# EAGLE design Tait USB programmer v2 (EAGLE 9.5.2)
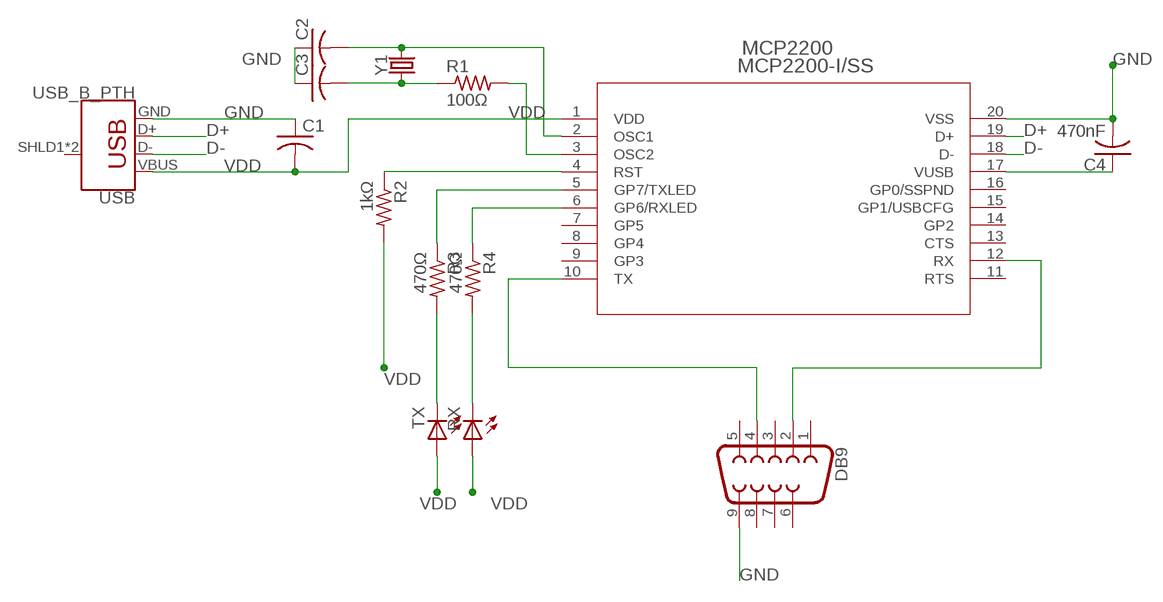
[diagram p0: schematic, sheet 1]

## Parts
C1  0.1uF  C-US025-025X050  [C025-025X050]
C2  22pF  C-US025-025X050  [C025-025X050]
C3  22pF  C-US025-025X050  [C025-025X050]
C4  470nF  C-US025-025X050  [C025-025X050]
DB9  DB9FEMALE  [DB9]
MCP2200  MCP2200-I/SS  [SSOP20_MC_MCH]
R1  100Ω  R-US_0204/7  [0204/7]
R2  1kΩ  R-US_0204/7  [0204/7]
R3  470Ω  R-US_0204/7  [0204/7]
R4  470Ω  R-US_0204/7  [0204/7]
RX  LED3MM  [LED3MM]
TX  LED3MM  [LED3MM]
USB  USB_B_PTH  [USB-B-PTH]
Y1  12MHz  CRYSTALPTH-HC49UV  [HC49U]

## Nets
D+: MCP2200.19(D+) USB.D+
D-: MCP2200.18(D-) USB.D-
GND: C1.1 C2.1 C3.1 C4.2 DB9.9 MCP2200.20(VSS) USB.GND
N$1: C3.2 R1.1 Y1.1
N$2: MCP2200.4(RST) R2.1
N$3: R3.2 TX.K(C)
N$4: C2.2 MCP2200.2(OSC1) Y1.2
N$5: C4.1 MCP2200.17(VUSB)
N$6: DB9.2 MCP2200.12(RX)
N$7: DB9.4 MCP2200.10(TX)
N$8: R4.2 RX.K(C)
N$9: MCP2200.6(GP6/RXLED) R4.1
N$10: MCP2200.3(OSC2) R1.2
N$11: MCP2200.5(GP7/TXLED) R3.1
VDD: C1.2 MCP2200.1(VDD) R2.2 RX.A TX.A USB.VBUS
Unconnected: DB9.1 DB9.3 DB9.5 DB9.6 DB9.7 DB9.8 MCP2200.7(GP5) MCP2200.8(GP4) MCP2200.9(GP3) MCP2200.11(RTS) MCP2200.13(CTS) MCP2200.14(GP2) MCP2200.15(GP1/USBCFG) MCP2200.16(GP0/SSPND) USB.SHLD1(SHIELD) USB.SHLD2(SHIELD)

## Library data of the parts
C1-C4 = adafruit:C-US: CAPACITOR, American symbol
DB9 = SparkFun-Connectors:DB9: DB9 Connector Standard DB9 (D-Sub 9) serial connector. Can be used for CAN bus as well as RS485 and RS232. Footprint production proven. Here is the female version connector we sell at SparkFun: 9 Pin Female Serial Connector - PCB Mount <https://www.sparkfun.com/products/429> (PRT-00429) This connector has been used on the following SparkFun products: SparkFun RS232 Shifter - SMD <https://www.sparkfun.com/products/449> (PRT-00449) SparkFun RS232 Shifter SMD (No DB9) <https://www.sparkfun.com/products/8780> (PRT-08780); PROD_ID: CONN-08194
MCP2200 = mcp2200:MCP2200-I/SS; BUILT_BY: EMA_UL_Team; MANUFACTURER_PART_NUMBER: mcp2200-i/ss; SOURCELIBRARY: Microchip_2011-05-13; VENDOR: Microchip
R1-R4 = adafruit:R-US_: RESISTOR, American symbol
RX TX = adafruit:LED: LED OSRAM: - CHIPLED LG R971, LG N971, LY N971, LG Q971, LY Q971, LO R971, LY R971 LH N974, LH R974 LS Q976, LO Q976, LY Q976 LO Q996 - Hyper CHIPLED LW Q18S LB Q993, LB Q99A, LB R99A - SideLED LS A670, LO A670, LY A670, LG A670, LP A670 LB A673, LV A673, LT A673, LW A673 LH A674 LY A675 LS A676, LA A676, LO A676, LY A676, LW A676 LS A679, LY A679, LG A679 - Hyper Micro SIDELED® LS Y876, LA Y876, LO Y876, LY Y876 LT Y87S - SmartLED LW L88C, LW L88S LB L89C, LB L89S, LG L890 LS L89K, LO L89K, LY L89K LS L896, LA L896, LO L896, LY L896 - TOPLED LS T670, LO T670, LY T670, LG T670, LP T670 LSG T670, LSP T670, LSY T670, LOP T670, LYG T670 LG T671, LOG T671, LSG T671 LB T673, LV T673, LT T673, LW T673 LH T674 LS T676, LA T676, LO T676, LY T676, LB T676, LH T676, LSB T676, LW T676 LB T67C, LV T67C, LT T67C, LS T67K, LO T67K, LY T67K, LW E67C LS E67B, LA E67B, LO E67B, LY E67B, LB E67C, LV E67C, LT E67C LW T67C LS T679, LY T679, LG T679 LS T770, LO T770, LY T770, LG T770, LP T770 LB T773, LV T773, LT T773, LW T773 LH T774 LS E675, LA E675, LY E675, LS T675 LS T776, LA T776, LO T776, LY T776, LB T776 LHGB T686 LT T68C, LB T68C - Hyper Mini TOPLED® LB M676 - Mini TOPLED Santana® LG M470 LS M47K, LO M47K, LY M47K Source: http://www.osram.convergy.de/
USB = SparkFun-Connectors:USB_B: USB Type B Connector SparkFun Products: SparkFun Stepoko <https://www.sparkfun.com/products/13899> PTH; PROD_ID: CONN-08278; SF_ID: PRT-00139
Y1 = SparkFun-Clocks:CRYSTAL: Crystals (Generic) These are passive quartz crystals, which can be used as a clock source for a microcontroller. Crystal's are two-terminal devices. They require external "load" capacitors to generate an oscillating signal.

## Board
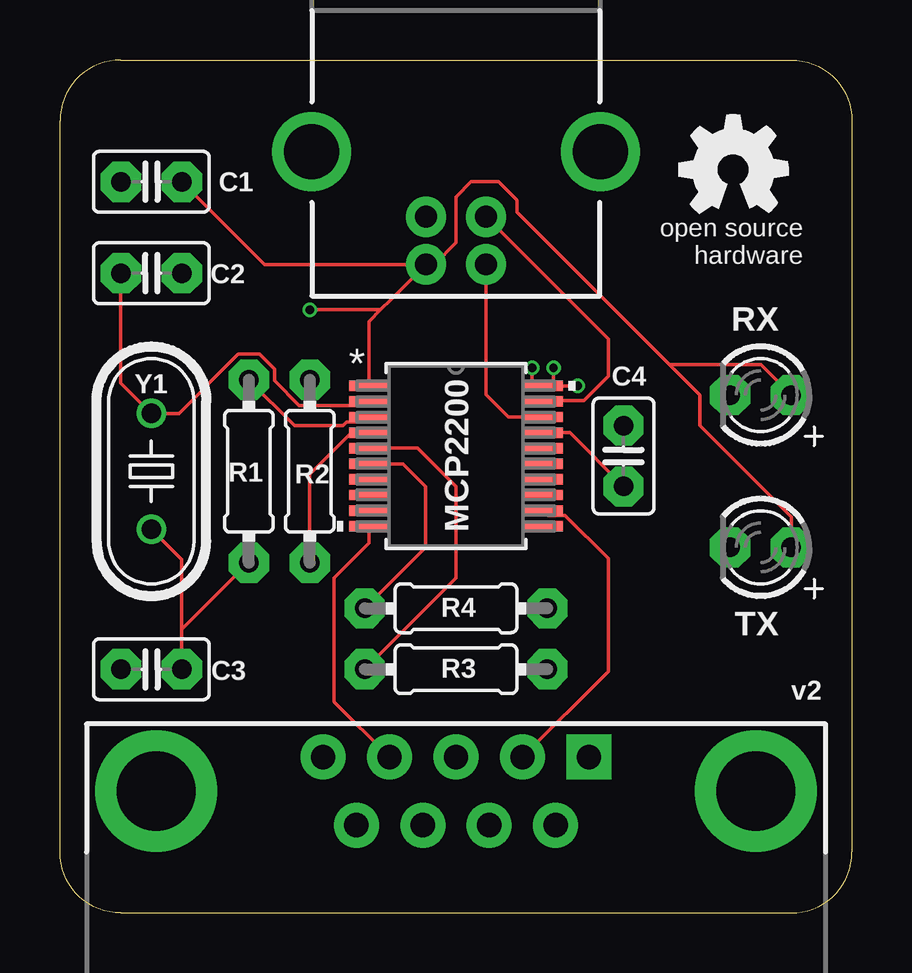
[diagram p1: board, top side]
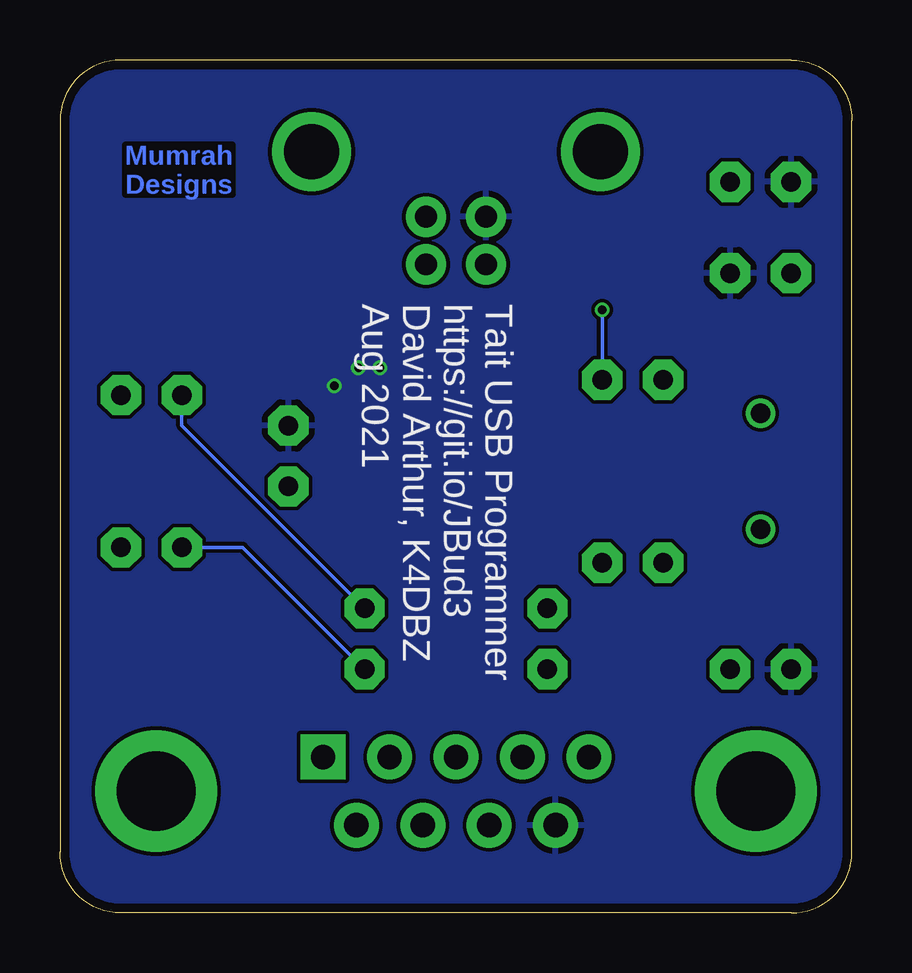
[diagram p2: board, bottom side, seen from below]

Size 33.02 x 35.56 mm. Coordinates in mm from the lower left corner, seen from the top.
Outline: 2.54,0 30.48,0 arc90 33.02,2.54 33.02,33.02 arc90 30.48,35.56 2.54,35.56 arc90 0,33.02 0,2.54 arc90 2.54,0
Copper layers (1*16): Top 0.035559375mm / dielectric 1.6mm / Bottom 0.035559375mm
Design rules "oshpark-2layer *": minimum track width 6mil, minimum drill 10mil, track to track 6mil, track to pad 6mil, pad to pad 6mil, via to via 6mil, smd to smd 6mil, copper to edge 15mil, drill to drill 6mil, minimum pad ring 5mil, minimum via ring 5mil, stop-mask expansion 2.5mil, vias tented up to drill 20mil, thermal gap 10mil

### Footprints (pad centres in the part's own frame; a part is rotated, then mirrored left to right if it is on the bottom)
C025-025X050 = drill 0.813 pad 1.676 octagon: 1 -1.27,0; 2 1.27,0
DB9 = drill 1.016 pad 1.88 square: 1 -5.54,-1.42 | drill 1.016 pad 1.88: 2 -2.77,-1.42; 3 0,-1.42; 4 2.77,-1.42; 5 5.54,-1.42; 6 -4.15,1.42; 7 -1.38,1.42; 8 1.38,1.42; 9 4.15,1.42 | drill 3.302 pad 5.08: G1 -12.5,0; G2 12.5,0
SSOP20_MC_MCH = smd 1.651 x 0.432: 1 -3.632,2.925; 2 -3.632,2.275; 3 -3.632,1.625; 4 -3.632,0.975; 5 -3.632,0.325; 6 -3.632,-0.325; 7 -3.632,-0.975; 8 -3.632,-1.625; 9 -3.632,-2.275; 10 -3.632,-2.925; 11 3.632,-2.925; 12 3.632,-2.275; 13 3.632,-1.625; 14 3.632,-0.975; 15 3.632,-0.325; 16 3.632,0.325; 17 3.632,0.975; 18 3.632,1.625; 19 3.632,2.275; 20 3.632,2.925
0204/7 = drill 0.813 pad 1.676 octagon: 1 -3.81,0; 2 3.81,0
LED3MM = drill 0.813 pad 1.676 octagon: A -1.27,0; K 1.27,0
USB-B-PTH = drill 0.914 pad 1.676: D+ 4,1.25; D- 5.981,1.25; GND 4,-1.25; VBUS 5.981,-1.25 | drill 2.286: SHLD1 1.282,-6.02; SHLD2 1.282,6.02
HC49U = drill 0.813: 1 -2.413,0; 2 2.413,0

### Placement (x,y rotation side)
C1  3.81,30.48 0 top
C2  3.81,26.67 180 top
C3  3.81,10.16 0 top
C4  23.5,19.05 90 top
DB9  16.51,5.08 180 top
MCP2200  16.51,19.05 0 top
R1  7.87,18.41 90 top
R2  10.41,18.41 90 top
R3  16.51,10.16 0 top
R4  16.51,12.7 0 top
RX  29.21,21.59 180 top
TX  29.21,15.24 180 top
U$1  [OSHW_5MM]  28.07,30.99 0 top
USB  16.51,33.02 270 top
Y1  3.81,18.41 90 top

### Tracks (layer width: path | path; a pad name or v marks a point on that pad's centre or on a via)
D+
  Top 0.152: USB.D+ 22.75,24.02 22.86,23.92 22.86,22.38 21.84,21.36 20.18,21.36 MCP2200.19
D-
  Top 0.152: MCP2200.18 18.7,20.68 17.76,21.61 USB.D-
GND  (via drill 0.35)
  Top 0.152: MCP2200.20 20.57,21.97 | 20.57,21.97 v21.59,21.97 | v20.57,22.73 20.57,21.97 | v19.68,22.73 19.68,22.1 19.56,21.97
  pour Bottom (isolate 0): -1.27,0 -1.27,40.64 34.29,40.64 34.29,-1.27 0,-1.27
N$1
  Top 0.152: R1.1 5.08,11.81 C3.2 5.08,14.73 Y1.1
N$2
  Top 0.152: MCP2200.4 12.16,20.02 10.41,18.28 R2.1
N$3
  Bottom 0.152: R3.2 25.4,15.24 TX.K
N$4
  Top 0.152: C2.2 2.54,22.1 Y1.2 4.97,20.83 7.43,23.29 8.32,23.29 8.94,22.67 8.94,22.19 9.97,21.16 12.71,21.16 MCP2200.2
N$5
  Top 0.152: MCP2200.17 21.25,20.02 C4.1
N$6
  Top 0.152: MCP2200.12 20.35,16.57 21.06,16.57 22.86,14.77 22.86,10.08 DB9.2
N$7
  Top 0.152: MCP2200.10 12.88,15.42 11.43,13.97 11.43,8.81 DB9.4
N$8
  Bottom 0.152: R4.2 27.94,20.32 RX.K
N$9
  Top 0.152: R4.1 15.24,15.24 15.24,17.78 14.29,18.73 MCP2200.6
N$10
  Top 0.152: R1.2 9.78,20.32 11.81,20.32 11.96,20.47 12.67,20.47 MCP2200.3
N$11
  Top 0.152: R3.1 16.51,13.97 16.51,17.78 14.91,19.38 MCP2200.5
VDD  (via drill 0.35)
  Top 0.152: C1.2 8.52,27.04 USB.VBUS | MCP2200.1 12.88,24.66 13.37,25.15 | USB.VBUS 13.8,25.57 13.37,25.15 | USB.VBUS 15.61,27.04 16.51,27.94 16.51,29.84 17.14,30.48 18.29,30.48 19.05,29.72 19.05,29.21 25.4,22.86 | TX.A 30.48,16.51 26.67,20.32 26.67,21.59 25.4,22.86 | 25.4,22.86 29.21,22.86 RX.A | v10.41,25.15 13.37,25.15
  Bottom 0.152: R2.2 v10.41,25.15

### Text on the board
Bottom: Mumrah / Designs
tNames: v2
bNames: Tait USB Programmer / https://git.io/JBud3 / David Arthur, K4DBZ / Aug 2021